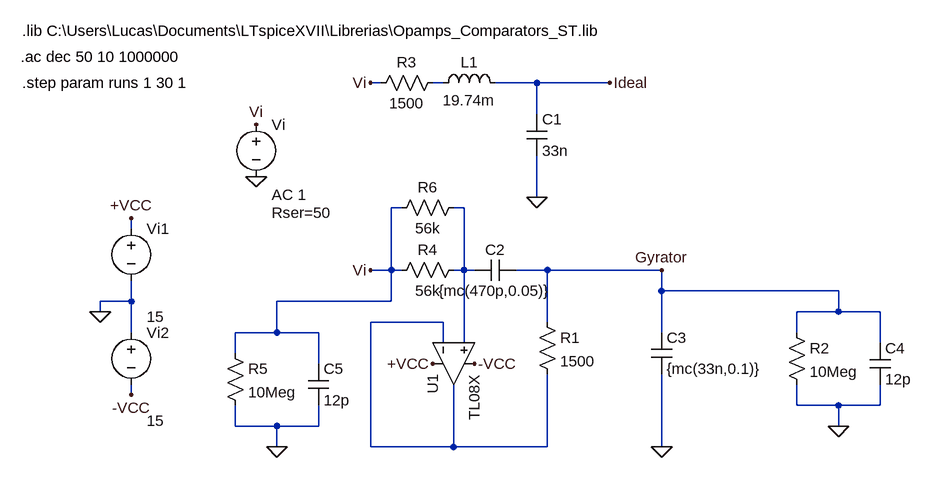
[diagram p0: schematic Pasabajos.asc]
Pasabajos.asc, the LTspice schematic file:
Version 4
SHEET 1 880 740
WIRE -128 128 -144 128
WIRE -32 128 -48 128
WIRE 112 128 48 128
WIRE 224 128 112 128
WIRE 112 176 112 128
WIRE 112 304 112 240
WIRE -96 320 -112 320
WIRE 0 320 -16 320
WIRE -512 352 -512 336
WIRE -112 416 -112 320
WIRE -112 416 -144 416
WIRE -96 416 -112 416
WIRE 0 416 0 320
WIRE 0 416 -16 416
WIRE 16 416 0 416
WIRE 128 416 80 416
WIRE 304 416 128 416
WIRE 304 448 304 416
WIRE 576 448 304 448
WIRE -512 464 -512 432
WIRE -512 464 -560 464
WIRE -112 464 -112 416
WIRE -112 464 -288 464
WIRE -560 480 -560 464
WIRE 576 480 576 448
WIRE 576 480 512 480
WIRE 640 480 576 480
WIRE -32 496 -144 496
WIRE 128 496 128 416
WIRE -512 512 -512 464
WIRE -288 512 -288 464
WIRE -288 512 -352 512
WIRE -224 512 -288 512
WIRE 304 512 304 448
WIRE 512 512 512 480
WIRE -32 528 -32 496
WIRE 0 528 0 416
WIRE 640 528 640 480
WIRE -352 544 -352 512
WIRE -224 560 -224 512
WIRE -512 608 -512 592
WIRE 512 624 512 592
WIRE 576 624 512 624
WIRE 640 624 640 592
WIRE 640 624 576 624
WIRE -352 656 -352 624
WIRE -288 656 -352 656
WIRE -224 656 -224 624
WIRE -224 656 -288 656
WIRE 576 656 576 624
WIRE -288 688 -288 656
WIRE -144 688 -144 496
WIRE -16 688 -16 592
WIRE -16 688 -144 688
WIRE 128 688 128 576
WIRE 128 688 -16 688
WIRE 304 688 304 576
FLAG 112 304 0
FLAG 224 128 Ideal
FLAG -144 128 Vi
FLAG -320 192 Vi
FLAG -320 272 0
FLAG -144 416 Vi
FLAG -512 336 +VCC
FLAG -512 608 -VCC
FLAG -560 480 0
FLAG -48 560 +VCC
FLAG 16 560 -VCC
FLAG 304 688 0
FLAG 304 416 Gyrator
FLAG 576 656 0
FLAG -288 688 0
SYMBOL voltage -320 176 R0
WINDOW 123 24 124 Left 2
WINDOW 39 24 152 Left 2
SYMATTR InstName Vi
SYMATTR Value ""
SYMATTR Value2 AC 1
SYMATTR SpiceLine Rser=50
SYMBOL Opamps\\opamp2 -80 560 M90
SYMATTR InstName U1
SYMATTR Value TL08X
SYMBOL voltage -512 336 R0
WINDOW 3 24 152 Left 2
WINDOW 123 24 124 Left 2
WINDOW 39 0 0 Left 0
SYMATTR InstName Vi1
SYMATTR Value 15
SYMBOL voltage -512 496 R0
WINDOW 3 24 152 Left 2
WINDOW 123 24 124 Left 2
WINDOW 39 0 0 Left 0
SYMATTR InstName Vi2
SYMATTR Value 15
SYMBOL res -32 112 R90
WINDOW 0 0 56 VBottom 2
WINDOW 3 32 56 VTop 2
SYMATTR InstName R3
SYMATTR Value 1500
SYMBOL ind -48 144 R270
WINDOW 0 32 56 VTop 2
WINDOW 3 5 56 VBottom 2
SYMATTR InstName L1
SYMATTR Value 19.74m
SYMBOL cap 96 176 R0
SYMATTR InstName C1
SYMATTR Value 33n
SYMBOL res 0 400 R90
WINDOW 0 0 56 VBottom 2
WINDOW 3 32 56 VTop 2
SYMATTR InstName R4
SYMATTR Value 56k
SYMBOL cap 80 400 R90
WINDOW 0 0 32 VBottom 2
WINDOW 3 32 32 VTop 2
SYMATTR InstName C2
SYMATTR Value {mc(470p,0.05)}
SYMBOL res 112 480 R0
SYMATTR InstName R1
SYMATTR Value 1500
SYMBOL cap 288 512 R0
SYMATTR InstName C3
SYMATTR Value {mc(33n,0.1)}
SYMBOL res 496 496 R0
SYMATTR InstName R2
SYMATTR Value 10Meg
SYMBOL cap 624 528 R0
SYMATTR InstName C4
SYMATTR Value 12p
SYMBOL res -368 528 R0
SYMATTR InstName R5
SYMATTR Value 10Meg
SYMBOL cap -240 560 R0
SYMATTR InstName C5
SYMATTR Value 12p
SYMBOL res 0 304 R90
WINDOW 0 0 56 VBottom 2
WINDOW 3 32 56 VTop 2
SYMATTR InstName R6
SYMATTR Value 56k
TEXT -682 88 Left 2 !.ac dec 50 10 1000000
TEXT -680 48 Left 2 !.lib C:\\Users\\Lucas\\Documents\\LTspiceXVII\\Librerias\\Opamps_Comparators_ST.lib
TEXT -680 128 Left 2 !.step param runs 1 30 1

The netlist it stands for:
* Pasabajos.asc
Vi Vi 0 AC 1 Rser=50
XU1 N002 N003 +VCC -VCC N003 TL08X  ; pins In+ In- V+ V- OUT
Vi1 +VCC 0 15
Vi2 0 -VCC 15
R3 N001 Vi 1500
L1 N001 Ideal 19.74m
C1 Ideal 0 33n
R4 N002 Vi 56k
C2 Gyrator N002 {mc(470p,0.05)}
R1 Gyrator N003 1500
C3 Gyrator 0 {mc(33n,0.1)}
R2 Gyrator 0 10Meg
C4 Gyrator 0 12p
R5 Vi 0 10Meg
C5 Vi 0 12p
R6 N002 Vi 56k
.ac dec 50 10 1000000
.lib C:\Users\Lucas\Documents\LTspiceXVII\Librerias\Opamps_Comparators_ST.lib
.step param runs 1 30 1
.backanno
.end